# EAGLE schematic pedals (EAGLE 8.6.0)
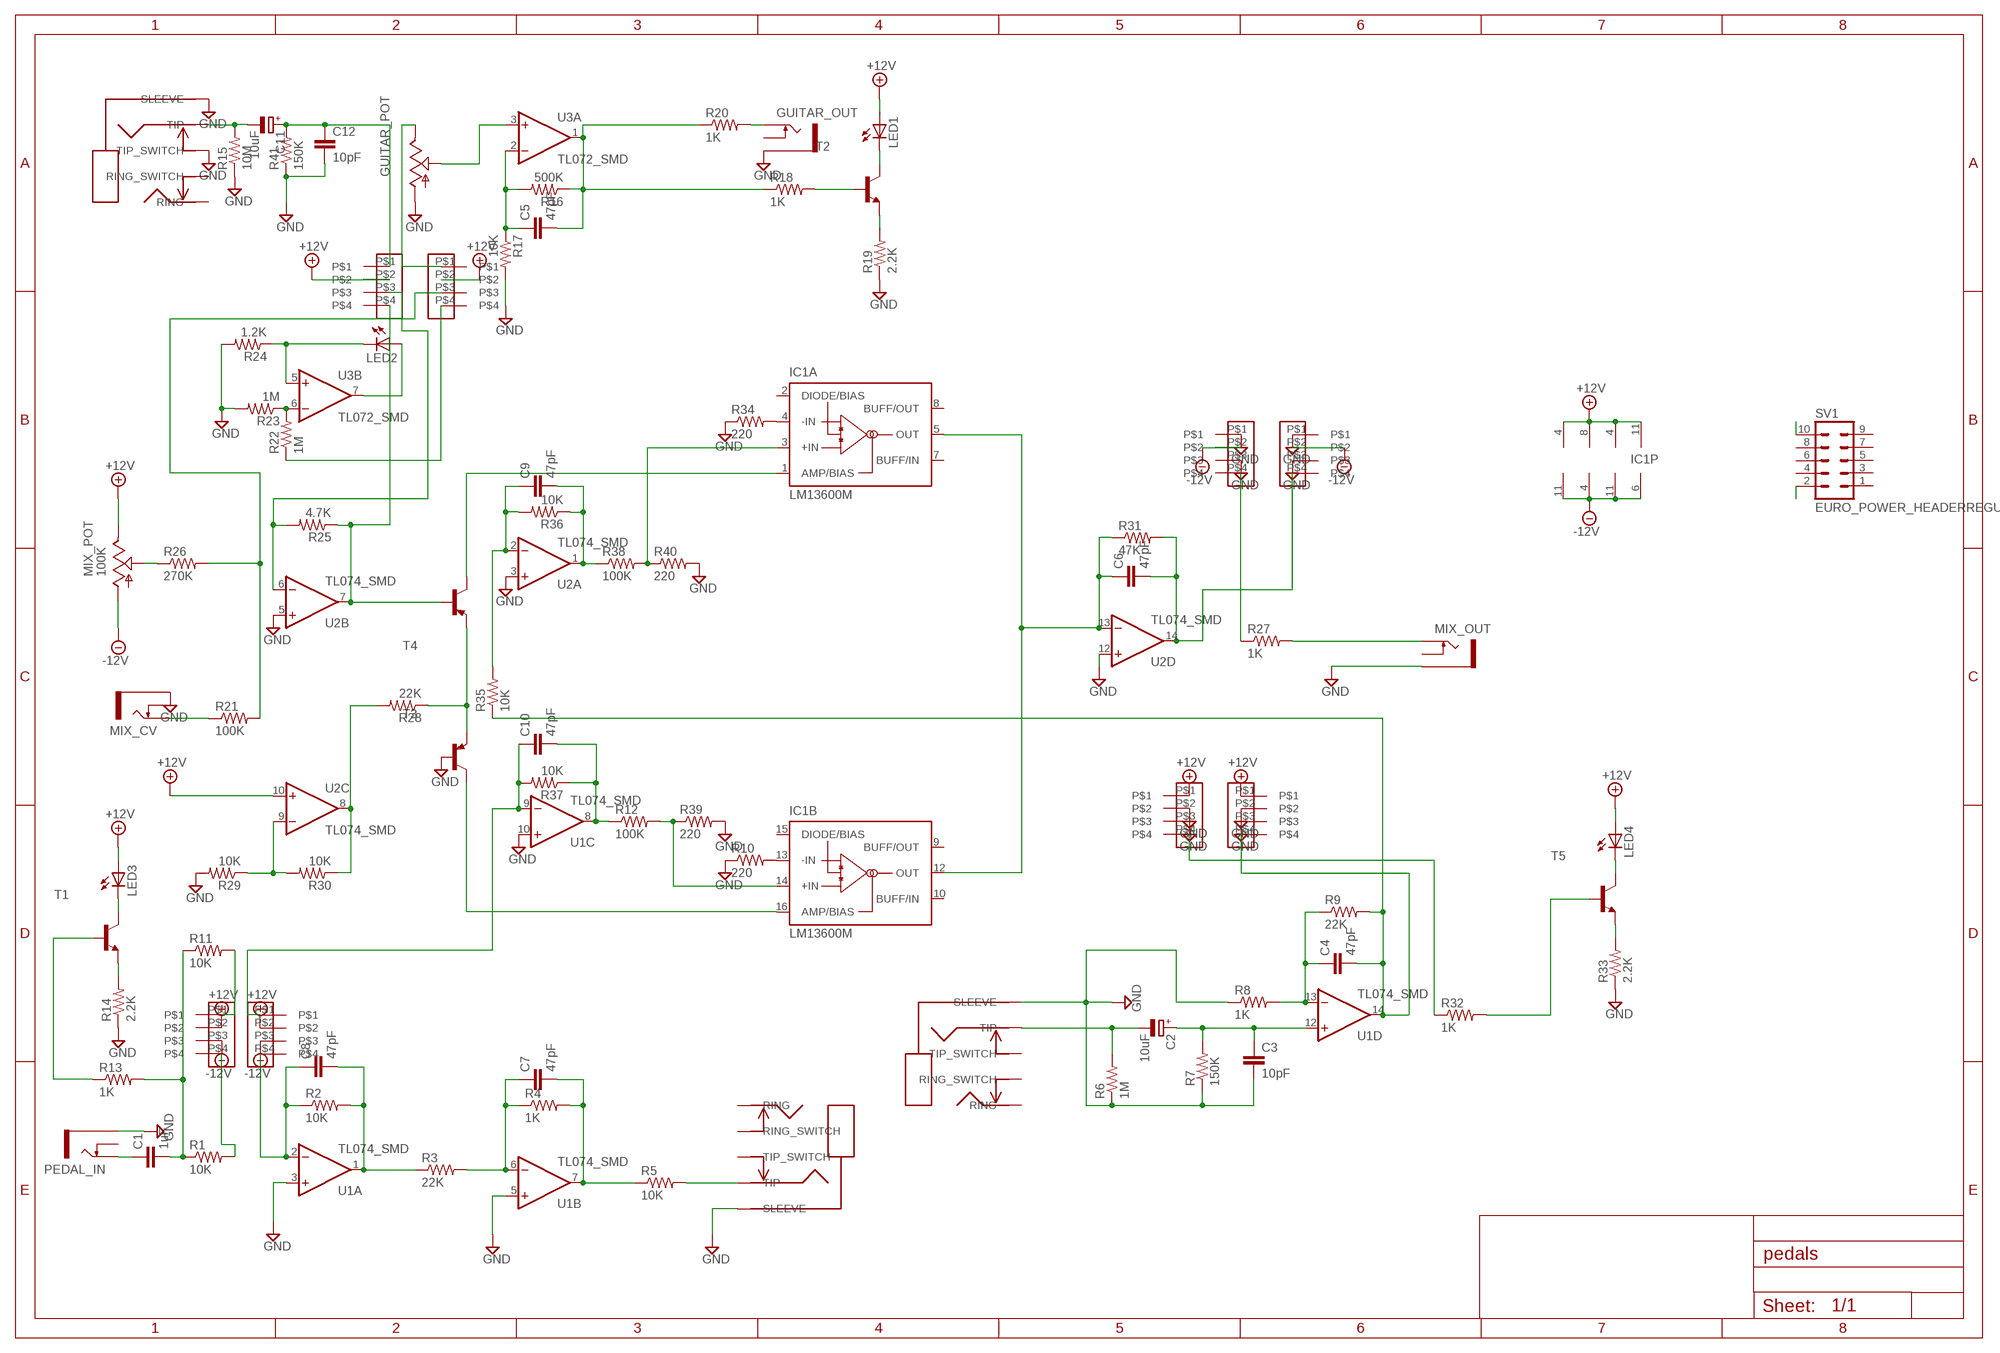
[diagram p0: schematic, sheet 1]

## Parts
C1  1uF  C-EUC0603  [C0603]
C2  10uF  CPOL-EUB  [PANASONIC_B]
C3  10pF  C-EUC0603  [C0603]
C4  47pF  C-EUC0603  [C0603]
C5  47pF  C-EUC0603  [C0603]
C6  47pF  C-EUC0603  [C0603]
C7  47pF  C-EUC0603  [C0603]
C8  47pF  C-EUC0603  [C0603]
C9  47pF  C-EUC0603  [C0603]
C10  47pF  C-EUC0603  [C0603]
C11  10uF  CPOL-EUB  [PANASONIC_B]
C12  10pF  C-EUC0603  [C0603]
GUITAR_INPUT  WQP-PJ612A  [JACK]
GUITAR_OUT  THONKICONNNEW  [WQP-PJ301M-12_JACK]
GUITAR_POT  9MM_SNAP-IN_POT_  [9MM_SNAP-IN_POT]
IC1  LM13600M  [SO16]
LB_B  4PIN_HEADER  [4PIN]
LB_O  4PIN_HEADER  [4PIN]
LED1  LED3MM  [LED3MM]
LED2  LED3MM  [LED3MM]
LED3  LED3MM  [LED3MM]
LED4  LED3MM  [LED3MM]
LO_B  4PIN_HEADER  [4PIN]
LO_O  4PIN_HEADER  [4PIN]
MIX_CV  THONKICONNNEW  [WQP-PJ301M-12_JACK]
MIX_OUT  THONKICONNNEW  [WQP-PJ301M-12_JACK]
MIX_POT  100K  9MM_SNAP-IN_POT_  [9MM_SNAP-IN_POT]
PEDAL-IN  WQP-PJ612A  [JACK]
PEDAL-OUT  WQP-PJ612A  [JACK]
PEDAL_IN  THONKICONNNEW  [WQP-PJ301M-12_JACK]
R1  10K  R-US_R0603  [R0603]
R2  10K  R-US_R0603  [R0603]
R3  22K  R-US_R0603  [R0603]
R4  1K  R-US_R0603  [R0603]
R5  10K  R-US_R0603  [R0603]
R6  1M  R-US_R0603  [R0603]
R7  150K  R-US_R0603  [R0603]
R8  1K  R-US_R0603  [R0603]
R9  22K  R-US_R0603  [R0603]
R10  220  R-US_R0603  [R0603]
R11  10K  R-US_R0603  [R0603]
R12  100K  R-US_R0603  [R0603]
R13  1K  R-US_R0603  [R0603]
R14  2.2K  R-US_R0603  [R0603]
R15  10M  R-US_R0603  [R0603]
R16  500K  R-US_R0603  [R0603]
R17  10K  R-US_R0603  [R0603]
R18  1K  R-US_R0603  [R0603]
R19  2.2K  R-US_R0603  [R0603]
R20  1K  R-US_R0603  [R0603]
R21  100K  R-US_R0603  [R0603]
R22  1M  R-US_R0603  [R0603]
R23  1M  R-US_R0603  [R0603]
R24  1.2K  R-US_R0603  [R0603]
R25  4.7K  R-US_R0603  [R0603]
R26  270K  R-US_R0603  [R0603]
R27  1K  R-US_R0603  [R0603]
R28  22K  R-US_R0603  [R0603]
R29  10K  R-US_R0603  [R0603]
R30  10K  R-US_R0603  [R0603]
R31  47K  R-US_R0603  [R0603]
R32  1K  R-US_R0603  [R0603]
R33  2.2K  R-US_R0603  [R0603]
R34  220  R-US_R0603  [R0603]
R35  10K  R-US_R0603  [R0603]
R36  10K  R-US_R0603  [R0603]
R37  10K  R-US_R0603  [R0603]
R38  100K  R-US_R0603  [R0603]
R39  220  R-US_R0603  [R0603]
R40  220  R-US_R0603  [R0603]
R41  150K  R-US_R0603  [R0603]
RB_B  4PIN_HEADER  [4PIN]
RB_O  4PIN_HEADER  [4PIN]
RO_B  4PIN_HEADER  [4PIN]
RO_O  4PIN_HEADER  [4PIN]
SV1  EURO_POWER_HEADERREGULAR  [EURO_POWER_HEADER]
T1  MMBT3904LT1-NPN-SOT23-BEC  [SOT23-BEC]
T2  MMBT3904LT1-NPN-SOT23-BEC  [SOT23-BEC]
T3  BC857A-PNP-SOT23-BEC  [SOT23-BEC]
T4  BC857A-PNP-SOT23-BEC  [SOT23-BEC]
T5  MMBT3904LT1-NPN-SOT23-BEC  [SOT23-BEC]
U1  TL074_SMD  [SO14]
U2  TL074_SMD  [SO14]
U3  TL072_SMD  [SO08]

## Nets
+12V: IC1.11(P:V+) LB_B.P$2 LB_O.P$2 LED1.A LED3.A LED4.A LO_B.P$2 LO_O.P$2 MIX_POT.3(E) RO_B.P$1 RO_O.P$1 U1.4(P:V+) U2.4(P:V+) U2.10(C:+IN) U3.8(P:V+)
-12V: IC1.6(P:V-) LO_B.P$3 LO_O.P$3 MIX_POT.1(A) RB_B.P$2 RB_O.P$2 U1.11(P:V-) U2.11(P:V-) U3.4(P:V-)
GND: C3.2 C12.2 GUITAR_INPUT.PIN1(SLEEVE) GUITAR_INPUT.PIN5(TIP_SWITCH) GUITAR_OUT.P$3_SLEEVE(SLEEVE) GUITAR_POT.1(A) MIX_CV.P$3_SLEEVE(SLEEVE) MIX_OUT.P$3_SLEEVE(SLEEVE) PEDAL-IN.PIN1(SLEEVE) PEDAL-OUT.PIN1(SLEEVE) PEDAL_IN.P$3_SLEEVE(SLEEVE) R6.1 R7.1 R8.1 R10.1 R14.1 R15.1 R17.2 R19.1 R23.2 R24.2 R29.2 R33.1 R34.1 R39.2 R40.2 R41.1 RB_B.P$1 RB_B.P$3 RB_O.P$1 RB_O.P$3 RO_B.P$2 RO_B.P$3 RO_O.P$2 RO_O.P$3 T3.B U1.3(A:+IN) U1.5(B:+IN) U1.10(C:+IN) U2.3(A:+IN) U2.5(B:+IN) U2.12(D:+IN)
N$1: C2.- PEDAL-IN.PIN3(TIP) R6.2
N$2: C11.- GUITAR_INPUT.PIN3(TIP) R15.2
N$3: C11.+ C12.1 LB_O.P$1 R41.2
N$4: IC1.13(B:-IN) R10.2
N$5: C2.+ C3.1 R7.2 U1.12(D:+IN)
N$6: C7.1 R3.2 R4.1 U1.6(B:-IN)
N$7: C7.2 R4.2 R5.1 U1.7(B:OUT)
N$8: PEDAL-OUT.PIN3(TIP) R5.2
N$9: C8.2 R2.2 R3.1 U1.1(A:OUT)
N$10: C1.2 R1.1 R11.1 R13.2
N$11: C4.1 R8.2 R9.1 U1.13(D:-IN)
N$12: C4.2 R9.2 R35.1 RO_O.P$4 U1.14(D:OUT)
N$13: C1.1 PEDAL_IN.P$1_TIP(TIP)
N$14: R13.1 T1.B
N$15: R14.2 T1.E
N$16: LED3.K(C) T1.C
N$17: C5.2 R16.1 R18.1 R20.1 U3.1(A:OUT)
N$18: C5.1 R16.2 R17.1 U3.2(A:-IN)
N$19: GUITAR_OUT.P$1_TIP(TIP) R20.2
N$20: R18.2 T2.B
N$21: R19.2 T2.E
N$22: LED1.K(C) T2.C
N$23: MIX_CV.P$1_TIP(TIP) R21.1
N$24: R22.2 R23.1 U3.6(B:-IN)
N$25: LED2.A U3.7(B:OUT)
N$26: LED2.K(C) R24.1 U3.5(B:+IN)
N$27: C6.2 R31.2 RB_O.P$4 U2.14(D:OUT)
N$28: LB_B.P$3 R21.2 R26.2
N$29: LB_O.P$4 R25.1 T4.B U2.7(B:OUT)
N$30: MIX_POT.2(S) R26.1
N$31: R28.1 T3.E T4.E
N$32: IC1.1(A:AMP/BIAS) T4.C
N$33: IC1.16(B:AMP/BIAS) T3.C
N$34: C6.1 IC1.5(A:OUT) IC1.12(B:OUT) R31.1 U2.13(D:-IN)
N$35: MIX_OUT.P$1_TIP(TIP) R27.2
N$36: R29.1 R30.2 U2.9(C:-IN)
N$37: R28.2 R30.1 U2.8(C:OUT)
N$38: IC1.4(A:-IN) R34.2
N$39: C8.1 LO_O.P$4 R2.1 U1.2(A:-IN)
N$40: R32.2 T5.B
N$41: R33.2 T5.E
N$42: LED4.K(C) T5.C
N$43: LO_B.P$4 R1.2
N$44: C9.1 R35.2 R36.2 U2.2(A:-IN)
N$45: C10.1 LO_O.P$1 R37.2 U1.9(C:-IN)
N$46: C10.2 R12.1 R37.1 U1.8(C:OUT)
N$47: C9.2 R36.1 R38.1 U2.1(A:OUT)
N$48: IC1.3(A:+IN) R38.2 R40.1
N$49: IC1.14(B:+IN) R12.2 R39.1
N$51: LB_B.P$4 R22.1
N$52: LO_B.P$1 R11.2
N$53: R32.1 RO_B.P$4
N$54: GUITAR_POT.3(E) LB_B.P$1
N$55: R27.1 RB_B.P$4
N$56: LB_O.P$3 R25.2 U2.6(B:-IN)
N$57: GUITAR_POT.2(S) U3.3(A:+IN)
N$59: SV1.10
N$60: SV1.2
Unconnected: GUITAR_INPUT.PIN2(RING) GUITAR_INPUT.PIN4(RING_SWITCH) GUITAR_OUT.P$2_SWITCH(SWITCH) IC1.2(A:DIODE/BIAS) IC1.7(A:BUFF/IN) IC1.8(A:BUFF/OUT) IC1.9(B:BUFF/OUT) IC1.10(B:BUFF/IN) IC1.15(B:DIODE/BIAS) MIX_CV.P$2_SWITCH(SWITCH) MIX_OUT.P$2_SWITCH(SWITCH) PEDAL-IN.PIN2(RING) PEDAL-IN.PIN4(RING_SWITCH) PEDAL-IN.PIN5(TIP_SWITCH) PEDAL-OUT.PIN2(RING) PEDAL-OUT.PIN4(RING_SWITCH) PEDAL-OUT.PIN5(TIP_SWITCH) PEDAL_IN.P$2_SWITCH(SWITCH) SV1.1 SV1.3 SV1.4 SV1.5 SV1.6 SV1.7 SV1.8 SV1.9

## Library data of the parts
C1 C3-C10 C12 = resistor:C-EU: CAPACITOR, European symbol
C2 C11 = resistor:CPOL-EU: POLARIZED CAPACITOR, European symbol
GUITAR_INPUT PEDAL-IN PEDAL-OUT = Chrisvossetje:WQP-PJ612A
GUITAR_OUT MIX_CV MIX_OUT PEDAL_IN = MusicThingModular:THONKICONN: 3.5mm socket for Eurorack modular synths
GUITAR_POT MIX_POT = MusicThingModular:9MM_SNAP-IN_POT: 9mm vertical snap-in pot, Alpha / Panasonic style
IC1 = national-semiconductor:LM13600: Dual Operational Transconductance Amplifiers with Linearizing Diodes and Buffers Source: lm13600.PDF
LB_B LB_O LO_B LO_O RB_B RB_O RO_B RO_O = Chrisvossetje:4PIN_HEADER
LED1-LED4 = led:LED: LED OSRAM: - CHIPLED LG R971, LG N971, LY N971, LG Q971, LY Q971, LO R971, LY R971 LH N974, LH R974 LS Q976, LO Q976, LY Q976 LO Q996 - Hyper CHIPLED LW Q18S LB Q993, LB Q99A, LB R99A - SideLED LS A670, LO A670, LY A670, LG A670, LP A670 LB A673, LV A673, LT A673, LW A673 LH A674 LY A675 LS A676, LA A676, LO A676, LY A676, LW A676 LS A679, LY A679, LG A679 - Hyper Micro SIDELED® LS Y876, LA Y876, LO Y876, LY Y876 LT Y87S - SmartLED LW L88C, LW L88S LB L89C, LB L89S, LG L890 LS L89K, LO L89K, LY L89K LS L896, LA L896, LO L896, LY L896 - TOPLED LS T670, LO T670, LY T670, LG T670, LP T670 LSG T670, LSP T670, LSY T670, LOP T670, LYG T670 LG T671, LOG T671, LSG T671 LB T673, LV T673, LT T673, LW T673 LH T674 LS T676, LA T676, LO T676, LY T676, LB T676, LH T676, LSB T676, LW T676 LB T67C, LV T67C, LT T67C, LS T67K, LO T67K, LY T67K, LW E67C LS E67B, LA E67B, LO E67B, LY E67B, LB E67C, LV E67C, LT E67C LW T67C LS T679, LY T679, LG T679 LS T770, LO T770, LY T770, LG T770, LP T770 LB T773, LV T773, LT T773, LW T773 LH T774 LS E675, LA E675, LY E675, LS T675 LS T776, LA T776, LO T776, LY T776, LB T776 LHGB T686 LT T68C, LB T68C - Hyper Mini TOPLED® LB M676 - Mini TOPLED Santana® LG M470 LS M47K, LO M47K, LY M47K Source: http://www.osram.convergy.de LUXEON: - LUMILED® LXK2-PW12-R00, LXK2-PW12-S00, LXK2-PW14-U00, LXK2-PW14-V00 LXK2-PM12-R00, LXK2-PM12-S00, LXK2-PM14-U00 LXK2-PE12-Q00, LXK2-PE12-R00, LXK2-PE12-S00, LXK2-PE14-T00, LXK2-PE14-U00 LXK2-PB12-K00, LXK2-PB12-L00, LXK2-PB12-M00, LXK2-PB14-N00, LXK2-PB14-P00, LXK2-PB14-Q00 LXK2-PR12-L00, LXK2-PR12-M00, LXK2-PR14-Q00, LXK2-PR14-R00 LXK2-PD12-Q00, LXK2-PD12-R00, LXK2-PD12-S00 LXK2-PH12-R00, LXK2-PH12-S00 LXK2-PL12-P00, LXK2-PL12-Q00, LXK2-PL12-R00 Source: www.luxeon.com KINGBRIGHT: KA-3528ASYC Source: www.kingbright.com
R1-R41 = resistor:R-US_: RESISTOR, American symbol
SV1 = MusicThingModular:EURO_POWER_HEADER: Power Header 10 pin power header for Eurorack Power Supplies Variants with fatter pads for easier soldering, and the LOCK variant which has 5mil offset pins to hold the component in place before soldering
T1 T2 T5 = MusicThingModular:*-NPN-: NPN Transistror BF959 corrected 2008.03.06
T3 T4 = MusicThingModular:*-PNP-: PNP Transistror
U1 U2 = MusicThingModular:TL074: Generic Quad Op Amp
U3 = MusicThingModular:TL072: Generic Dual Op Amp